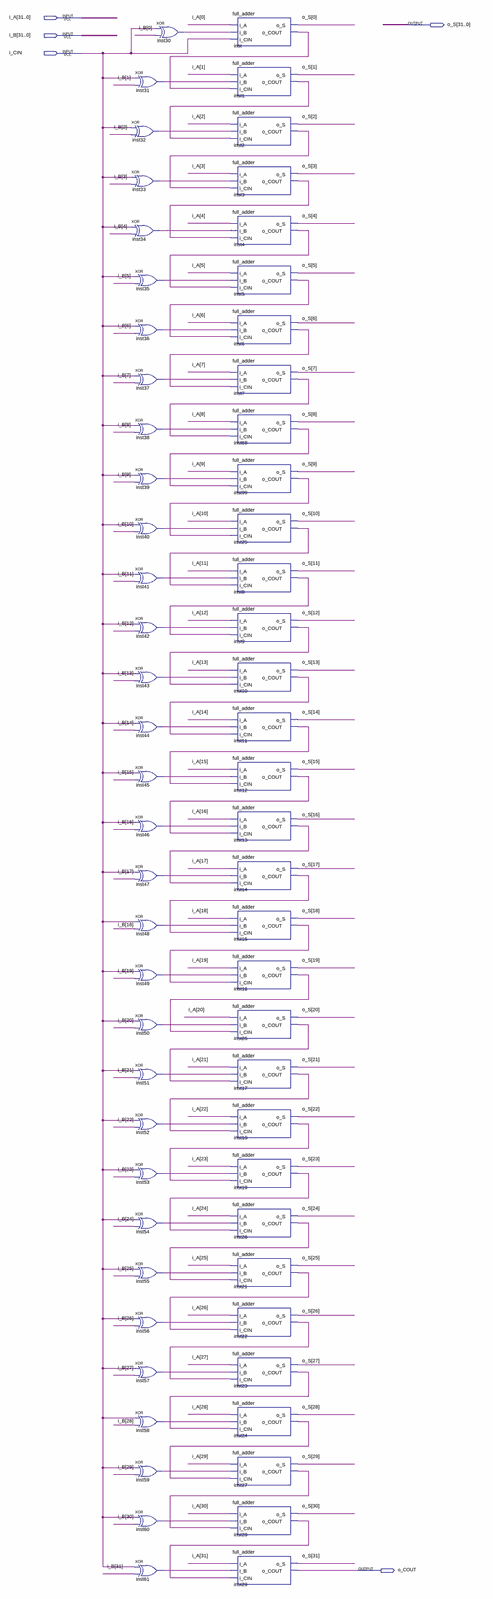
[diagram p0: schematic sheet, whole]
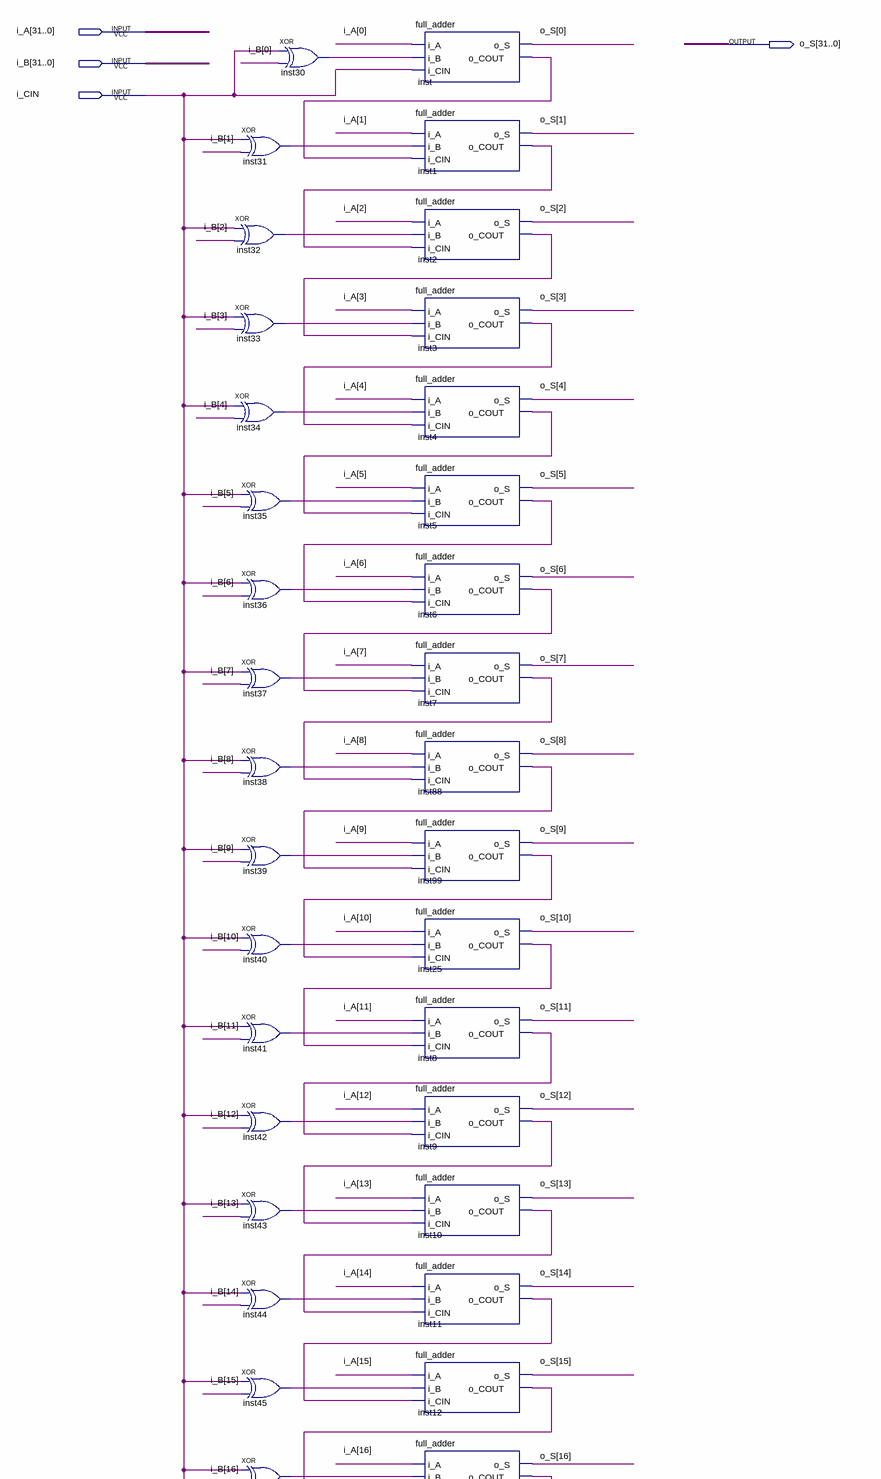
[diagram p1: schematic sheet, upper part]
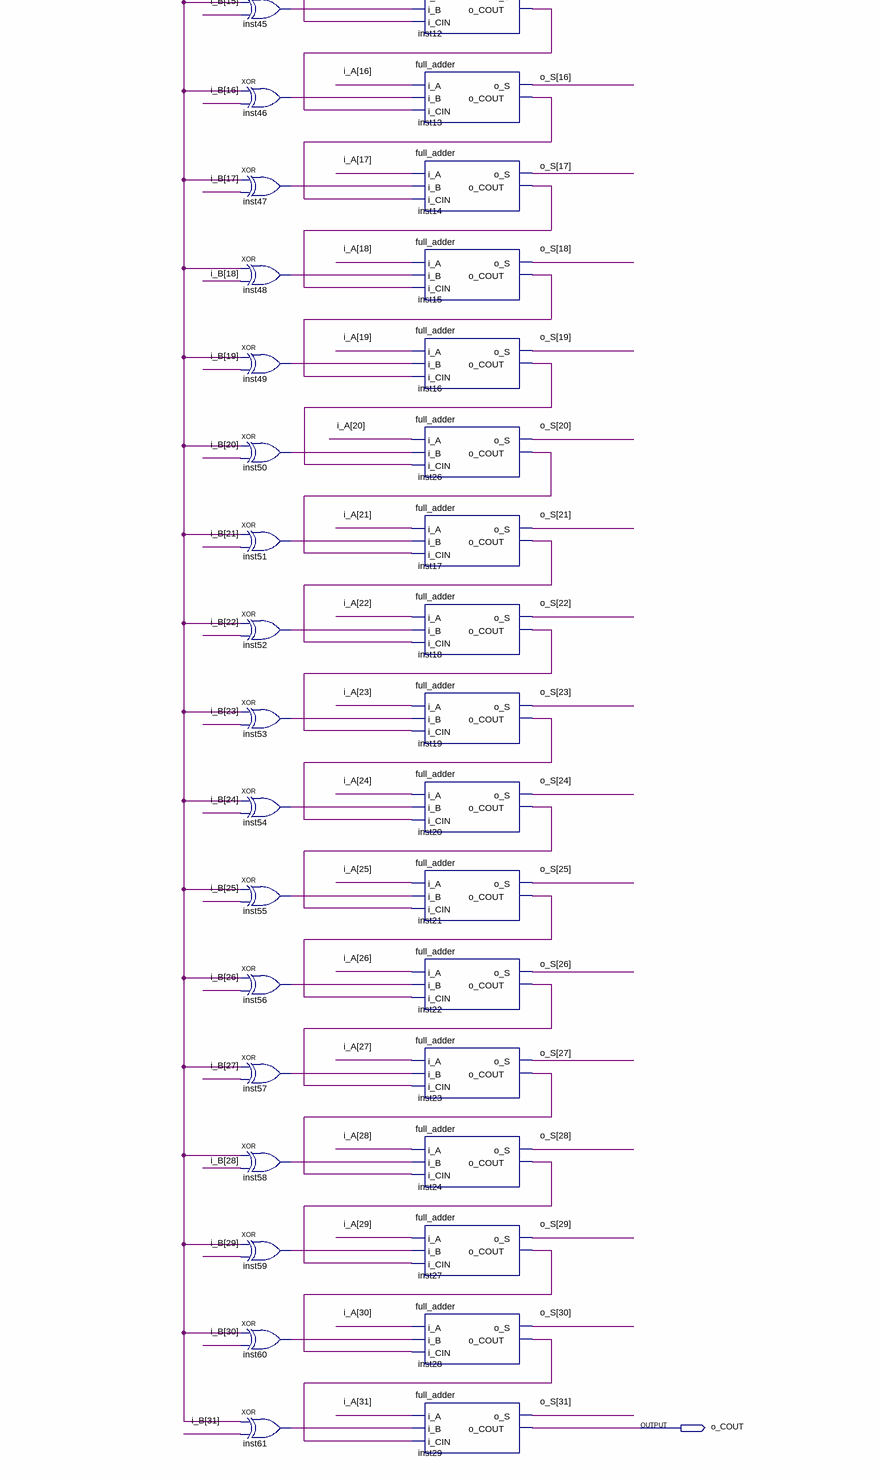
[diagram p2: schematic sheet, lower part]
// Quartus schematic add_sub.bdf as structural Verilog: 64 symbols, 5 pins
module add_sub (
  input  [31:0] i_A,
  input  [31:0] i_B,
  input  i_CIN,
  output [31:0] o_S,
  output o_COUT
);

  wire inst1_o_cout, inst2_o_cout, inst3_o_cout, inst4_o_cout, inst5_o_cout, inst6_o_cout, inst7_o_cout,
       inst8_o_cout, inst9_o_cout, inst10_o_cout, inst11_o_cout, inst12_o_cout, inst13_o_cout, inst14_o_cout,
       inst15_o_cout, inst16_o_cout, inst17_o_cout, inst18_o_cout, inst19_o_cout, inst20_o_cout,
       inst21_o_cout, inst22_o_cout, inst23_o_cout, inst24_o_cout, inst25_o_cout, inst26_o_cout,
       inst27_o_cout, inst28_o_cout, inst30_out, inst31_out, inst32_out, inst33_out, inst34_out, inst35_out,
       inst36_out, inst37_out, inst38_out, inst39_out, inst40_out, inst41_out, inst42_out, inst43_out,
       inst44_out, inst45_out, inst46_out, inst47_out, inst48_out, inst49_out, inst50_out, inst51_out,
       inst52_out, inst53_out, inst54_out, inst55_out, inst56_out, inst57_out, inst58_out, inst59_out,
       inst60_out, inst61_out, inst88_o_cout, inst99_o_cout, inst_o_cout;

  xor inst31 (inst31_out, i_CIN, i_B[1]);
  xor inst32 (inst32_out, i_CIN, i_B[2]);
  xor inst33 (inst33_out, i_CIN, i_B[3]);
  xor inst34 (inst34_out, i_CIN, i_B[4]);
  xor inst35 (inst35_out, i_CIN, i_B[5]);
  xor inst36 (inst36_out, i_CIN, i_B[6]);
  xor inst37 (inst37_out, i_CIN, i_B[7]);
  xor inst38 (inst38_out, i_CIN, i_B[8]);
  xor inst39 (inst39_out, i_CIN, i_B[9]);
  xor inst40 (inst40_out, i_CIN, i_B[10]);
  xor inst41 (inst41_out, i_CIN, i_B[11]);
  xor inst42 (inst42_out, i_CIN, i_B[12]);
  xor inst43 (inst43_out, i_CIN, i_B[13]);
  xor inst44 (inst44_out, i_CIN, i_B[14]);
  xor inst45 (inst45_out, i_CIN, i_B[15]);
  xor inst46 (inst46_out, i_CIN, i_B[16]);
  xor inst47 (inst47_out, i_CIN, i_B[17]);
  xor inst48 (inst48_out, i_CIN, i_B[18]);
  xor inst49 (inst49_out, i_CIN, i_B[19]);
  xor inst50 (inst50_out, i_CIN, i_B[20]);
  xor inst51 (inst51_out, i_CIN, i_B[21]);
  xor inst52 (inst52_out, i_CIN, i_B[22]);
  xor inst53 (inst53_out, i_CIN, i_B[23]);
  xor inst54 (inst54_out, i_CIN, i_B[24]);
  xor inst55 (inst55_out, i_CIN, i_B[25]);
  xor inst56 (inst56_out, i_CIN, i_B[26]);
  xor inst57 (inst57_out, i_CIN, i_B[27]);
  xor inst58 (inst58_out, i_CIN, i_B[28]);
  xor inst59 (inst59_out, i_CIN, i_B[29]);
  xor inst60 (inst60_out, i_CIN, i_B[30]);
  xor inst61 (inst61_out, i_CIN, i_B[31]);
  xor inst30 (inst30_out, i_CIN, i_B[0]);
  full_adder inst (.i_A(i_A[0]), .i_B(inst30_out), .i_CIN(i_CIN), .o_S(o_S[0]), .o_COUT(inst_o_cout));
  full_adder inst1 (.i_A(i_A[1]), .i_B(inst31_out), .i_CIN(inst_o_cout), .o_S(o_S[1]), .o_COUT(inst1_o_cout));
  full_adder inst2 (.i_A(i_A[2]), .i_B(inst32_out), .i_CIN(inst1_o_cout), .o_S(o_S[2]), .o_COUT(inst2_o_cout));
  full_adder inst3 (.i_A(i_A[3]), .i_B(inst33_out), .i_CIN(inst2_o_cout), .o_S(o_S[3]), .o_COUT(inst3_o_cout));
  full_adder inst4 (.i_A(i_A[4]), .i_B(inst34_out), .i_CIN(inst3_o_cout), .o_S(o_S[4]), .o_COUT(inst4_o_cout));
  full_adder inst5 (.i_A(i_A[5]), .i_B(inst35_out), .i_CIN(inst4_o_cout), .o_S(o_S[5]), .o_COUT(inst5_o_cout));
  full_adder inst6 (.i_A(i_A[6]), .i_B(inst36_out), .i_CIN(inst5_o_cout), .o_S(o_S[6]), .o_COUT(inst6_o_cout));
  full_adder inst7 (.i_A(i_A[7]), .i_B(inst37_out), .i_CIN(inst6_o_cout), .o_S(o_S[7]), .o_COUT(inst7_o_cout));
  full_adder inst88 (.i_A(i_A[8]), .i_B(inst38_out), .i_CIN(inst7_o_cout), .o_S(o_S[8]), .o_COUT(inst88_o_cout));
  full_adder inst99 (.i_A(i_A[9]), .i_B(inst39_out), .i_CIN(inst88_o_cout), .o_S(o_S[9]), .o_COUT(inst99_o_cout));
  full_adder inst25 (.i_A(i_A[10]), .i_B(inst40_out), .i_CIN(inst99_o_cout), .o_S(o_S[10]), .o_COUT(inst25_o_cout));
  full_adder inst8 (.i_A(i_A[11]), .i_B(inst41_out), .i_CIN(inst25_o_cout), .o_S(o_S[11]), .o_COUT(inst8_o_cout));
  full_adder inst9 (.i_A(i_A[12]), .i_B(inst42_out), .i_CIN(inst8_o_cout), .o_S(o_S[12]), .o_COUT(inst9_o_cout));
  full_adder inst10 (.i_A(i_A[13]), .i_B(inst43_out), .i_CIN(inst9_o_cout), .o_S(o_S[13]), .o_COUT(inst10_o_cout));
  full_adder inst11 (.i_A(i_A[14]), .i_B(inst44_out), .i_CIN(inst10_o_cout), .o_S(o_S[14]), .o_COUT(inst11_o_cout));
  full_adder inst12 (.i_A(i_A[15]), .i_B(inst45_out), .i_CIN(inst11_o_cout), .o_S(o_S[15]), .o_COUT(inst12_o_cout));
  full_adder inst13 (.i_A(i_A[16]), .i_B(inst46_out), .i_CIN(inst12_o_cout), .o_S(o_S[16]), .o_COUT(inst13_o_cout));
  full_adder inst14 (.i_A(i_A[17]), .i_B(inst47_out), .i_CIN(inst13_o_cout), .o_S(o_S[17]), .o_COUT(inst14_o_cout));
  full_adder inst15 (.i_A(i_A[18]), .i_B(inst48_out), .i_CIN(inst14_o_cout), .o_S(o_S[18]), .o_COUT(inst15_o_cout));
  full_adder inst16 (.i_A(i_A[19]), .i_B(inst49_out), .i_CIN(inst15_o_cout), .o_S(o_S[19]), .o_COUT(inst16_o_cout));
  full_adder inst26 (.i_A(i_A[20]), .i_B(inst50_out), .i_CIN(inst16_o_cout), .o_S(o_S[20]), .o_COUT(inst26_o_cout));
  full_adder inst17 (.i_A(i_A[21]), .i_B(inst51_out), .i_CIN(inst26_o_cout), .o_S(o_S[21]), .o_COUT(inst17_o_cout));
  full_adder inst18 (.i_A(i_A[22]), .i_B(inst52_out), .i_CIN(inst17_o_cout), .o_S(o_S[22]), .o_COUT(inst18_o_cout));
  full_adder inst19 (.i_A(i_A[23]), .i_B(inst53_out), .i_CIN(inst18_o_cout), .o_S(o_S[23]), .o_COUT(inst19_o_cout));
  full_adder inst20 (.i_A(i_A[24]), .i_B(inst54_out), .i_CIN(inst19_o_cout), .o_S(o_S[24]), .o_COUT(inst20_o_cout));
  full_adder inst21 (.i_A(i_A[25]), .i_B(inst55_out), .i_CIN(inst20_o_cout), .o_S(o_S[25]), .o_COUT(inst21_o_cout));
  full_adder inst22 (.i_A(i_A[26]), .i_B(inst56_out), .i_CIN(inst21_o_cout), .o_S(o_S[26]), .o_COUT(inst22_o_cout));
  full_adder inst23 (.i_A(i_A[27]), .i_B(inst57_out), .i_CIN(inst22_o_cout), .o_S(o_S[27]), .o_COUT(inst23_o_cout));
  full_adder inst24 (.i_A(i_A[28]), .i_B(inst58_out), .i_CIN(inst23_o_cout), .o_S(o_S[28]), .o_COUT(inst24_o_cout));
  full_adder inst27 (.i_A(i_A[29]), .i_B(inst59_out), .i_CIN(inst24_o_cout), .o_S(o_S[29]), .o_COUT(inst27_o_cout));
  full_adder inst28 (.i_A(i_A[30]), .i_B(inst60_out), .i_CIN(inst27_o_cout), .o_S(o_S[30]), .o_COUT(inst28_o_cout));
  full_adder inst29 (.i_A(i_A[31]), .i_B(inst61_out), .i_CIN(inst28_o_cout), .o_S(o_S[31]), .o_COUT(o_COUT));
endmodule
